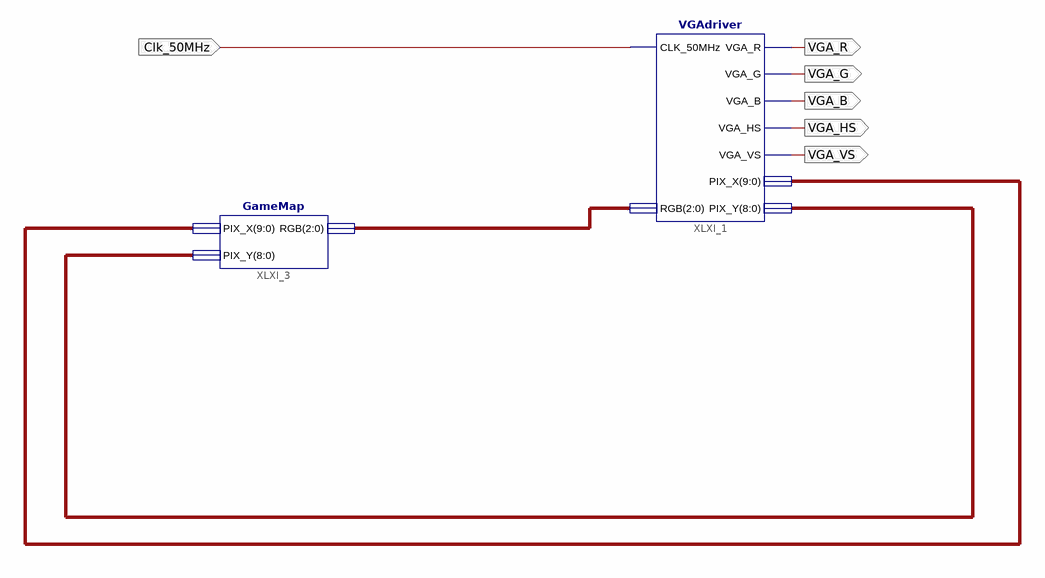
[diagram p0: schematic sheet 1]
// Xilinx ISE schematic Scheme.sch (spartan3e) as structural Verilog: 2 symbols, 6 ports
module Scheme (
  input  Clk_50MHz,
  output VGA_R,
  output VGA_G,
  output VGA_B,
  output VGA_HS,
  output VGA_VS
);

  wire [2:0] XLXN_3;
  wire [8:0] XLXN_2;
  wire [9:0] XLXN_1;

  VGAdriver XLXI_1 (
    .CLK_50MHz(Clk_50MHz), .RGB(XLXN_3), .VGA_R(VGA_R), .VGA_G(VGA_G), .VGA_B(VGA_B), .VGA_HS(VGA_HS),
    .VGA_VS(VGA_VS), .PIX_X(XLXN_1), .PIX_Y(XLXN_2));
  GameMap XLXI_3 (.PIX_X(XLXN_1), .PIX_Y(XLXN_2), .RGB(XLXN_3));
endmodule
